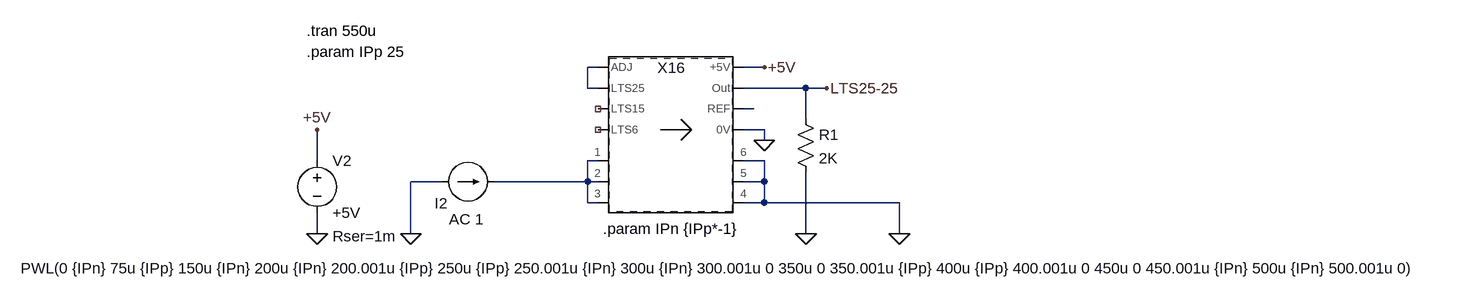
[diagram p0: schematic LTS-XX_hy_Test_Transient.asc]
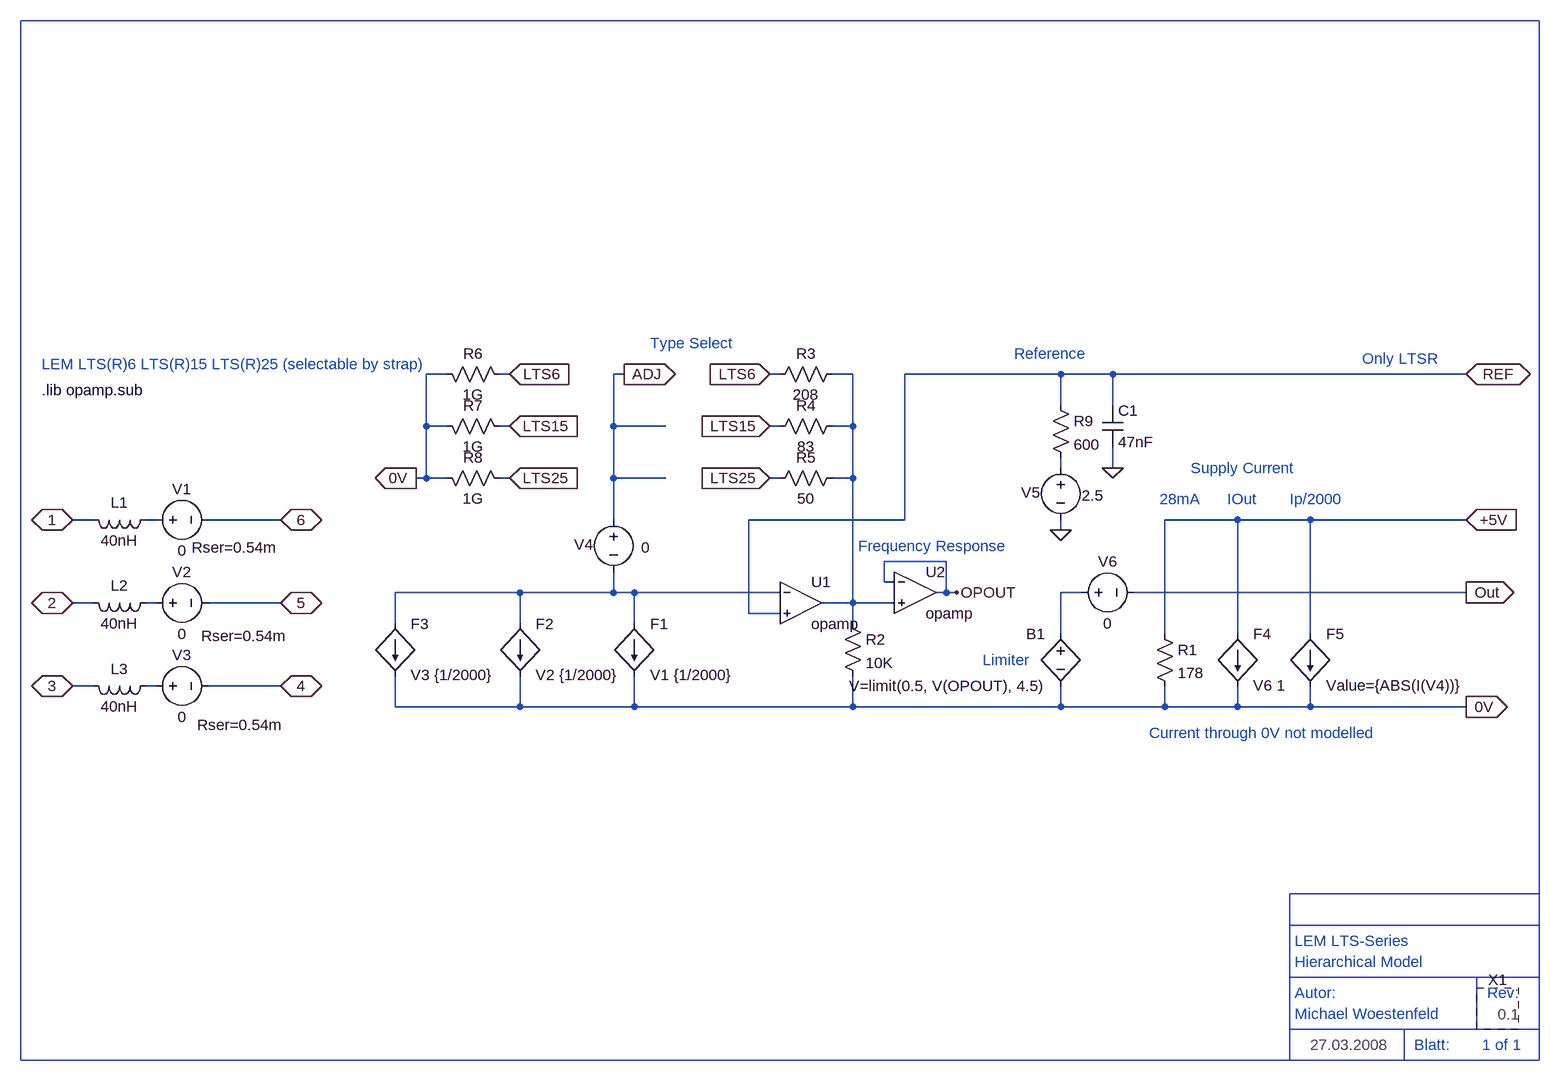
[diagram p1: sub-circuit lts-xx_hy.asc]
LTS-XX_hy_Test_Transient.asc, the LTspice schematic file:
Version 4
SHEET 1 2536 1600
WIRE -384 336 -400 336
WIRE -128 336 -160 336
WIRE -400 368 -400 336
WIRE -384 368 -400 368
WIRE -64 368 -160 368
WIRE -32 368 -64 368
WIRE -144 400 -160 400
WIRE -64 416 -64 368
WIRE -128 432 -160 432
WIRE -128 448 -128 432
WIRE -816 480 -816 432
WIRE -384 480 -400 480
WIRE -128 480 -160 480
WIRE -624 512 -672 512
WIRE -400 512 -400 480
WIRE -400 512 -544 512
WIRE -384 512 -400 512
WIRE -128 512 -128 480
WIRE -128 512 -160 512
WIRE -400 544 -400 512
WIRE -384 544 -400 544
WIRE -128 544 -128 512
WIRE -128 544 -160 544
WIRE 80 544 -128 544
WIRE -816 592 -816 560
WIRE -672 592 -672 512
WIRE -64 592 -64 496
WIRE 80 592 80 544
FLAG -672 592 0
FLAG -128 448 0
FLAG -816 592 0
FLAG -816 432 +5V
FLAG -128 336 +5V
FLAG -32 368 LTS25-25
FLAG -64 592 0
FLAG 80 592 0
SYMBOL voltage -816 464 R0
WINDOW 123 0 0 Left 0
WINDOW 39 24 132 Left 0
SYMATTR SpiceLine Rser=1m
SYMATTR InstName V2
SYMATTR Value +5V
SYMBOL res -80 400 R0
SYMATTR InstName R1
SYMATTR Value 2K
SYMBOL current -624 512 M90
WINDOW 123 58 64 VLeft 0
WINDOW 39 0 0 Left 0
WINDOW 3 133 1535 VLeft 0
WINDOW 0 33 9 VLeft 0
SYMATTR Value2 AC 1
SYMATTR Value PWL(0 {IPn} 75u {IPp} 150u {IPn} 200u {IPn} 200.001u {IPp} 250u {IPp} 250.001u {IPn} 300u {IPn} 300.001u 0 350u 0 350.001u {IPp} 400u {IPp} 400.001u 0 450u 0 450.001u {IPn} 500u {IPn} 500.001u 0)
SYMATTR InstName I2
SYMBOL LTS-XX_hy -272 448 R0
SYMATTR InstName X16
TEXT -832 280 Left 0 !.tran 550u
TEXT -832 312 Left 0 !.param IPp 25
TEXT -376 584 Left 0 !.param IPn {IPp*-1}

lts-xx_hy.asc, the sub-circuit schematic file:
Version 4
SHEET 1 2536 916
WIRE -464 -320 -496 -320
WIRE -368 -320 -384 -320
WIRE -192 -320 -208 -320
WIRE 48 -320 32 -320
WIRE 160 -320 128 -320
WIRE 480 -320 240 -320
WIRE 560 -320 480 -320
WIRE 1104 -320 560 -320
WIRE 480 -272 480 -320
WIRE 560 -272 560 -320
WIRE -496 -240 -496 -320
WIRE -464 -240 -496 -240
WIRE -368 -240 -384 -240
WIRE -208 -240 -208 -320
WIRE -128 -240 -208 -240
WIRE 48 -240 32 -240
WIRE 160 -240 160 -320
WIRE 160 -240 128 -240
WIRE 480 -176 480 -192
WIRE 560 -176 560 -208
WIRE -496 -160 -496 -240
WIRE -496 -160 -512 -160
WIRE -464 -160 -496 -160
WIRE -368 -160 -384 -160
WIRE -208 -160 -208 -240
WIRE -128 -160 -208 -160
WIRE 48 -160 32 -160
WIRE 160 -160 160 -240
WIRE 160 -160 128 -160
WIRE -1008 -96 -1040 -96
WIRE -912 -96 -928 -96
WIRE -720 -96 -832 -96
WIRE -208 -96 -208 -160
WIRE 240 -96 240 -320
WIRE 240 -96 0 -96
WIRE 752 -96 640 -96
WIRE 864 -96 752 -96
WIRE 1104 -96 864 -96
WIRE 480 -80 480 -96
WIRE 304 -32 208 -32
WIRE 208 0 208 -32
WIRE 224 0 208 0
WIRE -352 16 -544 16
WIRE -208 16 -208 -16
WIRE -208 16 -352 16
WIRE -176 16 -208 16
WIRE 48 16 -176 16
WIRE 304 16 304 -32
WIRE 304 16 288 16
WIRE 320 16 304 16
WIRE 512 16 480 16
WIRE 1104 16 592 16
WIRE -1008 32 -1040 32
WIRE -912 32 -928 32
WIRE -720 32 -832 32
WIRE 160 32 160 -160
WIRE 160 32 112 32
WIRE 224 32 160 32
WIRE 0 48 0 -96
WIRE 48 48 0 48
WIRE -544 64 -544 16
WIRE -352 64 -352 16
WIRE -176 64 -176 16
WIRE 160 64 160 32
WIRE 480 80 480 16
WIRE 640 80 640 -96
WIRE 752 80 752 -96
WIRE 864 80 864 -96
WIRE -1008 160 -1040 160
WIRE -912 160 -928 160
WIRE -720 160 -832 160
WIRE -544 192 -544 144
WIRE -352 192 -352 144
WIRE -352 192 -544 192
WIRE -176 192 -176 144
WIRE -176 192 -352 192
WIRE 160 192 160 144
WIRE 160 192 -176 192
WIRE 480 192 480 160
WIRE 480 192 160 192
WIRE 640 192 640 160
WIRE 640 192 480 192
WIRE 752 192 752 160
WIRE 752 192 640 192
WIRE 864 192 864 160
WIRE 864 192 752 192
WIRE 1104 192 864 192
FLAG -1040 -96 1
IOPIN -1040 -96 BiDir
FLAG -1040 32 2
IOPIN -1040 32 BiDir
FLAG -1040 160 3
IOPIN -1040 160 BiDir
FLAG -720 -96 6
IOPIN -720 -96 BiDir
FLAG -720 32 5
IOPIN -720 32 BiDir
FLAG -720 160 4
IOPIN -720 160 BiDir
FLAG 1104 -96 +5V
IOPIN 1104 -96 In
FLAG 1104 16 Out
IOPIN 1104 16 Out
FLAG 1104 192 0V
IOPIN 1104 192 Out
FLAG 320 16 OPOUT
FLAG -192 -320 ADJ
IOPIN -192 -320 Out
FLAG 32 -320 LTS6
IOPIN 32 -320 In
FLAG 32 -240 LTS15
IOPIN 32 -240 In
FLAG 32 -160 LTS25
IOPIN 32 -160 In
FLAG -368 -320 LTS6
IOPIN -368 -320 In
FLAG -368 -240 LTS15
IOPIN -368 -240 In
FLAG -368 -160 LTS25
IOPIN -368 -160 In
FLAG -512 -160 0V
IOPIN -512 -160 Out
FLAG 480 -80 0
FLAG 1104 -320 REF
IOPIN 1104 -320 BiDir
FLAG 560 -176 0
SYMBOL voltage -928 -96 R270
WINDOW 0 32 56 VTop 0
WINDOW 3 -32 56 VBottom 0
WINDOW 123 0 0 Left 0
WINDOW 39 -58 137 VTop 0
SYMATTR InstName V1
SYMATTR Value 0
SYMATTR SpiceLine Rser=0.54m
SYMBOL voltage -928 32 R270
WINDOW 0 32 56 VTop 0
WINDOW 3 -32 56 VBottom 0
WINDOW 123 0 0 Left 0
WINDOW 39 -35 152 VBottom 0
SYMATTR InstName V2
SYMATTR Value 0
SYMATTR SpiceLine Rser=0.54m
SYMBOL voltage -928 160 R270
WINDOW 0 32 56 VTop 0
WINDOW 3 -32 56 VBottom 0
WINDOW 123 0 0 Left 0
WINDOW 39 -44 146 VBottom 0
SYMATTR InstName V3
SYMATTR Value 0
SYMATTR SpiceLine Rser=0.54m
SYMBOL res 144 -336 R90
WINDOW 0 0 56 VBottom 0
WINDOW 3 32 56 VTop 0
SYMATTR InstName R3
SYMATTR Value 208
SYMBOL voltage 480 -192 M0
WINDOW 0 46 70 Bottom 0
WINDOW 3 -49 43 Top 0
WINDOW 123 0 0 Left 0
WINDOW 39 -58 137 VTop 0
SYMATTR InstName V5
SYMATTR Value 2.5
SYMBOL voltage 496 16 R270
WINDOW 0 32 56 VTop 0
WINDOW 3 -32 56 VBottom 0
WINDOW 123 0 0 Left 0
WINDOW 39 -58 137 VTop 0
SYMATTR InstName V6
SYMATTR Value 0
SYMBOL f -176 64 R0
WINDOW 3 24 79 Left 0
SYMATTR Value V1 {1/2000}
SYMATTR InstName F1
SYMBOL f -352 64 R0
WINDOW 3 24 79 Left 0
SYMATTR Value V2 {1/2000}
SYMATTR InstName F2
SYMBOL f -544 64 R0
WINDOW 3 24 79 Left 0
SYMATTR Value V3 {1/2000}
SYMATTR InstName F3
SYMBOL res 624 64 R0
SYMATTR InstName R1
SYMATTR Value 178
SYMBOL f 752 80 R0
WINDOW 3 24 79 Left 0
SYMATTR Value V6 1
SYMATTR InstName F4
SYMBOL Opamps\\opamp 256 -48 R0
SYMATTR InstName U2
SYMATTR SpiceLine2 GBW=1.5Meg
SYMBOL res 144 48 R0
SYMATTR InstName R2
SYMATTR Value 10K
SYMBOL bv 480 64 M0
SYMATTR InstName B1
SYMATTR Value V=limit(0.5, V(OPOUT), 4.5)
SYMBOL res 144 -256 R90
WINDOW 0 0 56 VBottom 0
WINDOW 3 32 56 VTop 0
SYMATTR InstName R4
SYMATTR Value 83
SYMBOL res 144 -176 R90
WINDOW 0 0 56 VBottom 0
WINDOW 3 32 56 VTop 0
SYMATTR InstName R5
SYMATTR Value 50
SYMBOL res -480 -336 M90
WINDOW 0 0 56 VBottom 0
WINDOW 3 32 56 VTop 0
SYMATTR InstName R6
SYMATTR Value 1G
SYMBOL res -480 -256 M90
WINDOW 0 0 56 VBottom 0
WINDOW 3 32 56 VTop 0
SYMATTR InstName R7
SYMATTR Value 1G
SYMBOL res -480 -176 M90
WINDOW 0 0 56 VBottom 0
WINDOW 3 32 56 VTop 0
SYMATTR InstName R8
SYMATTR Value 1G
SYMBOL voltage -208 -112 M0
WINDOW 0 46 70 Bottom 0
WINDOW 3 -49 43 Top 0
WINDOW 123 0 0 Left 0
WINDOW 39 -58 137 VTop 0
SYMATTR InstName V4
SYMATTR Value 0
SYMBOL f 864 80 R0
WINDOW 3 24 79 Left 0
SYMATTR Value Value={ABS(I(V4))}
SYMATTR InstName F5
SYMBOL res 464 -288 R0
SYMATTR InstName R9
SYMATTR Value 600
SYMBOL cap 544 -272 R0
SYMATTR InstName C1
SYMATTR Value 47nF
SYMBOL Opamps\\opamp 80 -32 R0
SYMATTR InstName U1
SYMBOL ind -912 -112 R90
WINDOW 0 5 56 VBottom 0
WINDOW 3 32 56 VTop 0
SYMATTR InstName L1
SYMATTR Value 40nH
SYMBOL ind -912 16 R90
WINDOW 0 5 56 VBottom 0
WINDOW 3 32 56 VTop 0
SYMATTR InstName L2
SYMATTR Value 40nH
SYMBOL ind -912 144 R90
WINDOW 0 5 56 VBottom 0
WINDOW 3 32 56 VTop 0
SYMATTR InstName L3
SYMATTR Value 40nH
SYMBOL Version 1152 656 R0
SYMATTR InstName X1
TEXT -1088 -296 Left 0 !.lib opamp.sub
TEXT -1088 -336 Left 0 ;LEM LTS(R)6 LTS(R)15 LTS(R)25 (selectable by strap)
TEXT 632 -128 Left 0 ;28mA
TEXT 736 -128 Left 0 ;IOut
TEXT 832 -128 Left 0 ;Ip/2000
TEXT 680 -176 Left 0 ;Supply Current
TEXT 616 232 Left 0 ;Current through 0V not modelled
TEXT -152 -368 Left 0 ;Type Select
TEXT 944 -344 Left 0 ;Only LTSR
TEXT 408 -352 Left 0 ;Reference
TEXT 168 -56 Left 0 ;Frequency Response
TEXT 360 120 Left 0 ;Limiter
TEXT 1024 712 Left 0 ;Blatt:
TEXT 1136 632 Left 0 ;Rev:
TEXT 840 632 Left 0 ;Autor:
TEXT 1128 712 Left 0 ;1 of 1
TEXT 840 664 Left 0 ;Michael Woestenfeld
TEXT 840 552 Left 0 ;LEM LTS-Series
TEXT 840 584 Left 0 ;Hierarchical Model
LINE Normal 832 480 1216 480
LINE Normal 832 736 832 480
LINE Normal 832 528 1216 528
RECTANGLE Normal -1120 -864 1216 736
RECTANGLE Normal 1216 736 1008 688
RECTANGLE Normal 1008 736 832 688
RECTANGLE Normal 1216 688 1120 608
RECTANGLE Normal 1120 688 832 608

The netlist it stands for:
* LTS-XX_hy_Test_Transient.asc
V2 +5V 0 +5V Rser=1m
R1 LTS25-25 0 2K
I2 0 N003 PWL(0 {IPn} 75u {IPp} 150u {IPn} 200u {IPn} 200.001u {IPp} 250u {IPp} 250.001u {IPn} 300u {IPn} 300.001u 0 350u 0 350.001u {IPp} 400u {IPp} 400.001u 0 450u 0 450.001u {IPn} 500u {IPn} 500.001u 0) AC 1
XX16 +5V 0 LTS25-25 N003 N003 N003 0 0 0 N001 N001 NC_01 NC_02 N002 lts-xx_hy

* block symbol definitions
.subckt lts-xx_hy +5V 0V Out 1 2 3 4 5 6 ADJ LTS25 LTS15 LTS6 REF
V1 N003 6 0 Rser=0.54m
V2 N006 5 0 Rser=0.54m
V3 N007 4 0 Rser=0.54m
R3 N001 LTS6 208
V5 N002 0 2.5
V6 N005 Out 0
F1 N004 0V V1 {1/2000}
F2 N004 0V V2 {1/2000}
F3 N004 0V V3 {1/2000}
R1 +5V 0V 178
F4 +5V 0V V6 1
XU2 OPOUT N001 OPOUT opamp Aol=100K GBW=1.5Meg  ; pins invin noninvin out
R2 N001 0V 10K
B1 N005 0V V=limit(0.5, V(OPOUT), 4.5)
R4 N001 LTS15 83
R5 N001 LTS25 50
R6 0V LTS6 1G
R7 0V LTS15 1G
R8 0V LTS25 1G
V4 ADJ N004 0
F5 +5V 0V Value={ABS(I(V4))}
R9 REF N002 600
C1 REF 0 47nF
XU1 N004 REF N001 opamp Aol=100K GBW=10Meg  ; pins invin noninvin out
L1 N003 1 40nH
L2 N006 2 40nH
L3 N007 3 40nH
XX1 Version
.lib opamp.sub
* LEM LTS(R)6 LTS(R)15 LTS(R)25 (selectable by strap)
* 28mA
* IOut
* Ip/2000
* Supply Current
* Current through 0V not modelled
* Type Select
* Only LTSR
* Reference
* Frequency Response
* Limiter
* Blatt:
* Rev:
* Autor:
* 1 of 1
* Michael Woestenfeld
* LEM LTS-Series
* Hierarchical Model
.ends lts-xx_hy

.tran 550u
.param IPp 25
.param IPn {IPp*-1}
.backanno
.end